# Altium project 平衡车Board_V1.0.PrjPCB
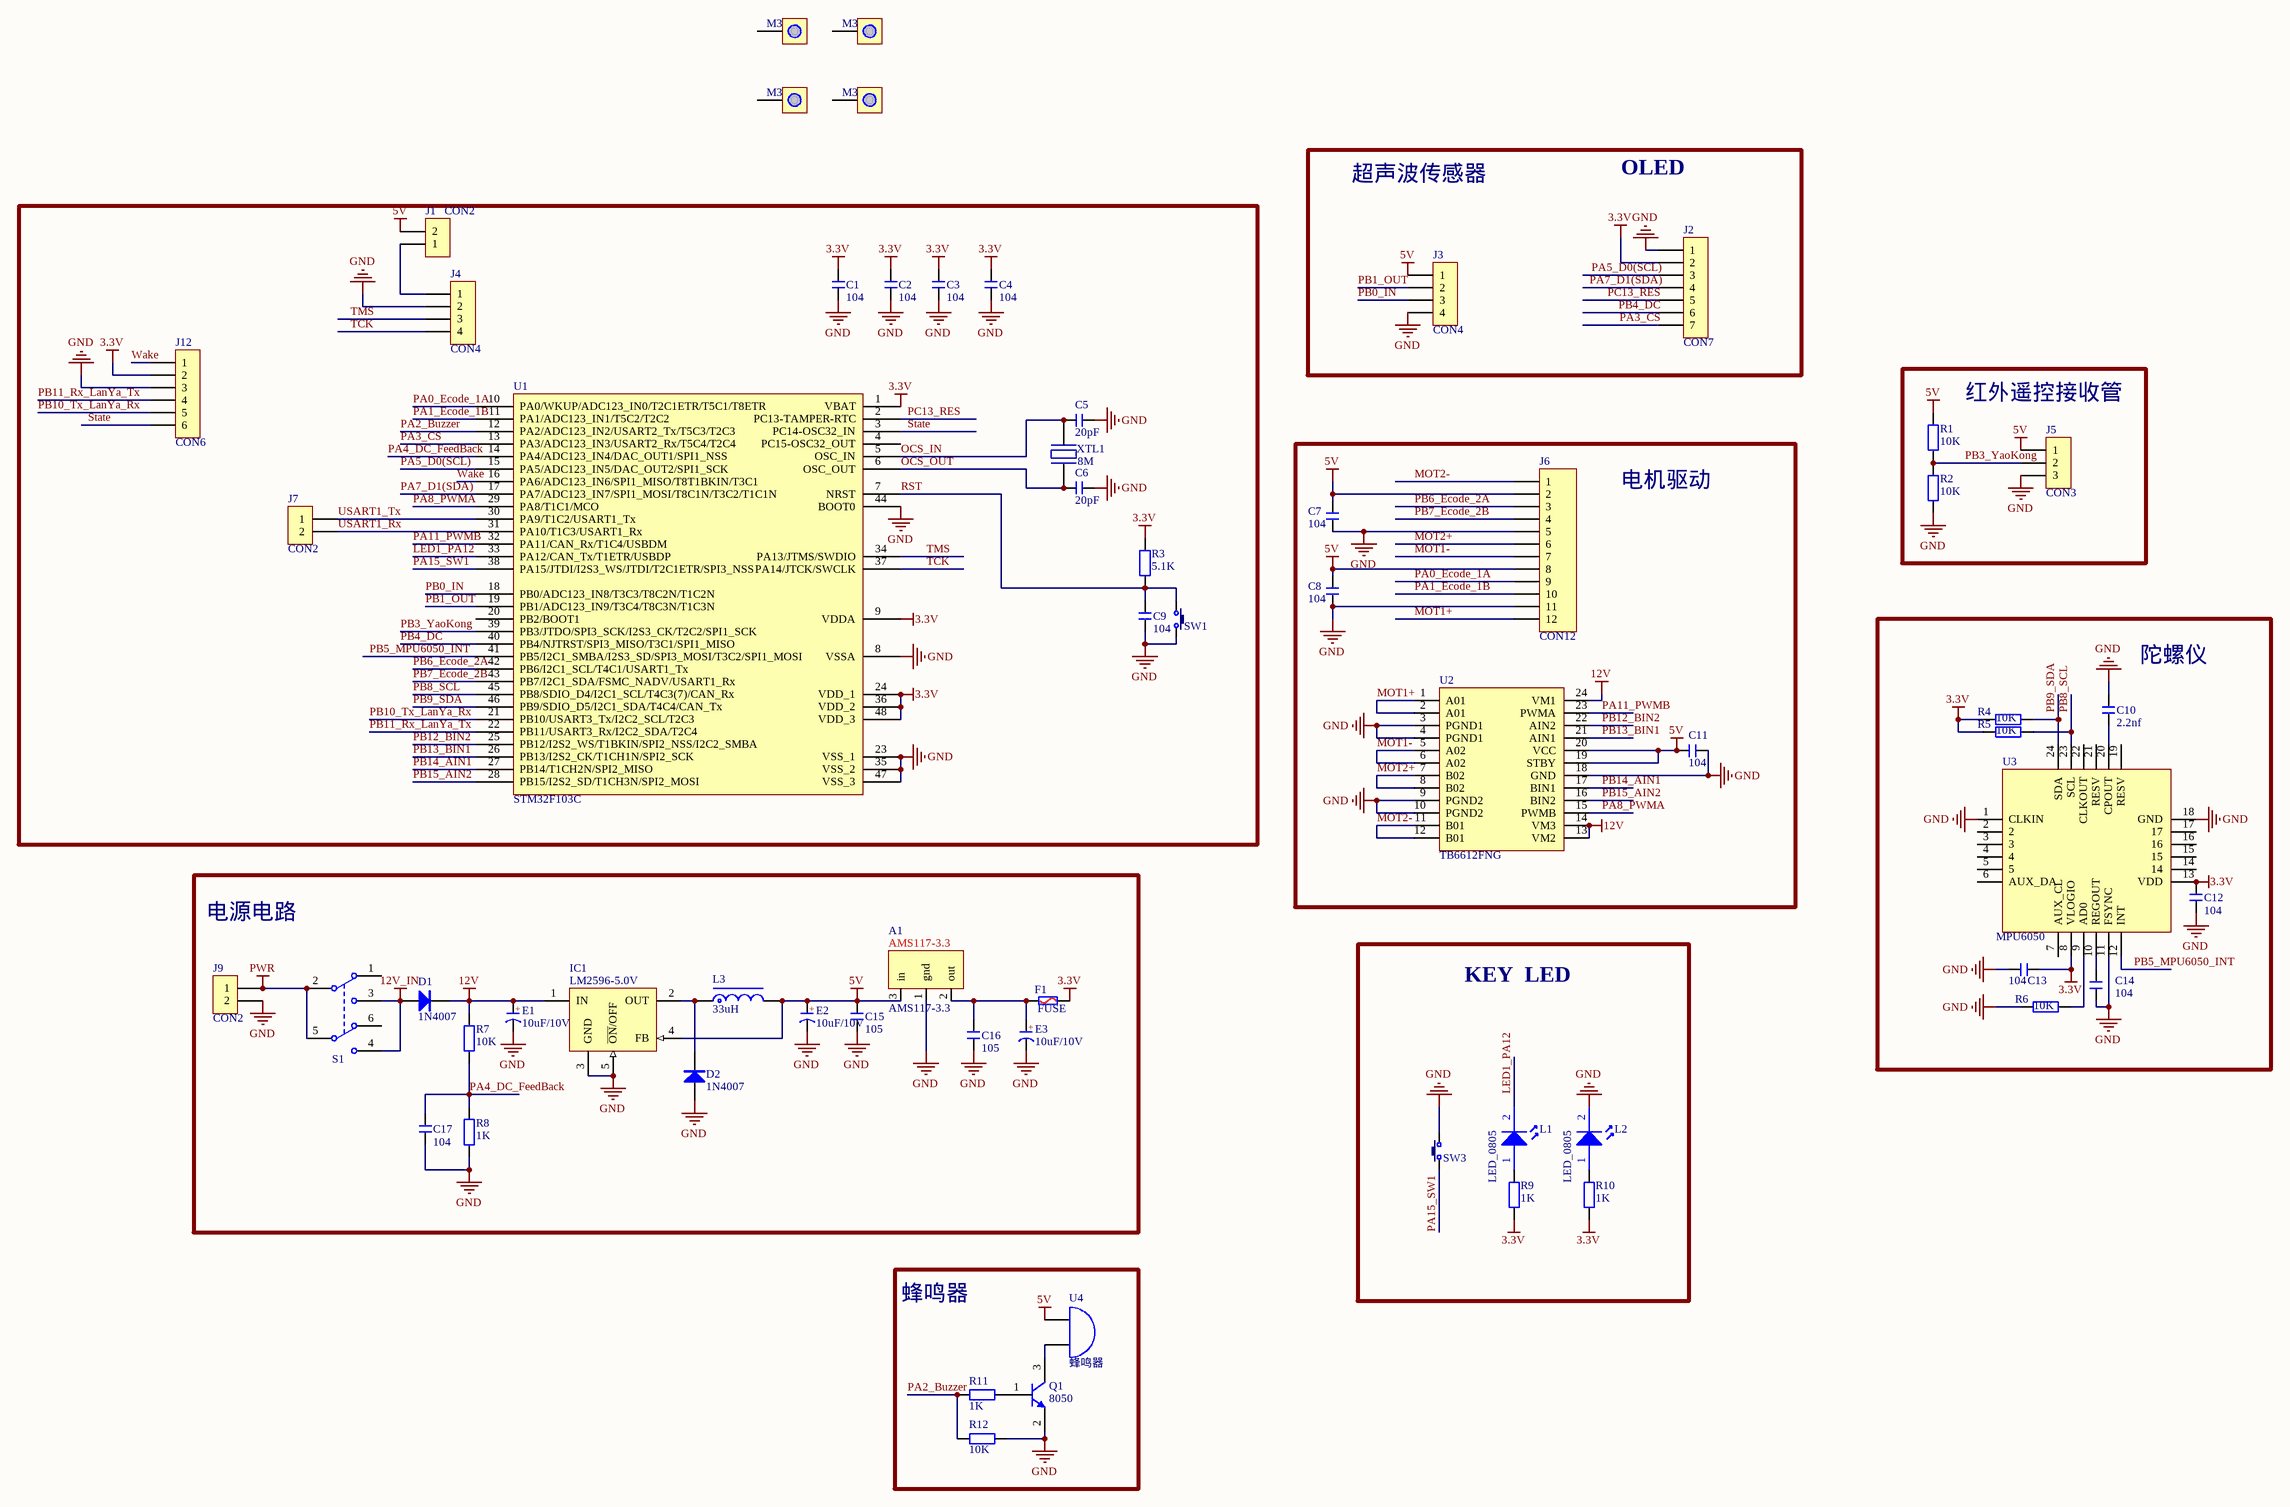
[diagram p0: 平衡车Board_V1.0.SchDoc]
1 sheet, 62 parts. Net scope: global (net labels, ports and power ports of the same name join across sheets).
Board file: 平衡车Board_V1.0.PcbDoc

## Sheet 平衡车Board_V1.0.SchDoc
size A2; PageSetup: Record=PageOptions|CenterHorizontal=True|CenterVertical=True|PrintScale=0.70|XCorrection=1.00|YCorrection=1.00|PrintKind=1|BorderSize=5000000|LeftOffset=0|BottomOffset=0|Orientation=2|PaperLength=1000|PaperWidth=1000|Scale=100|PaperSource=15|PrintQuality=600|MediaType=1|DitherType=10|PaperKind=A3|PrintScaleMode=1

### Parts
A1  AMS117-3.3  [SOT223_N]
C1  104  [C 0603_M]
C2  104  [C 0603_M]
C3  104  [C 0603_M]
C4  104  [C 0603_M]
C5  20pF  [C 0603_M]
C6  20pF  [C 0603_M]
C7  104  [C 0603_M]
C8  104  [C 0603_M]
C9  104  [C 0603_M]
C10  2.2nf  [C 0603_M]
C11  104  [C 0603_M]
C12  104  [C 0603_M]
C13  104  [C 0603_M]
C14  104  [C 0603_M]
C15  105  [C 0805_M]
C16  105  [C 0805_M]
C17  104  [C 0603_M]
D1  1N4007  [DO-41]
D2  1N4007  [DO-41]
E1  10uF/10V  [CM D(6.3*7.7)]
E2  10uF/10V  [CM D(6.3*7.7)]
E3  10uF/10V  [CM D(6.3*7.7)]
F1  FUSE  [FU 1206]
IC1  LM2596-5.0V  [TO263-5A]
J1  CON2  [HDR2.54-LI-2P]
J2  CON7  [HDR2.54-M-LI-7P - for-Oled]
J3  CON4  [HDR2.54-M-LI-4P]
J4  CON4  [HDR2.54-WI-4P]
J5  CON3  [TO92A - duplicate]
J6  CON12  [XH2.54-LI-12P]
J7  CON2  [HDR2.54-LI-2P]
J9  CON2  [CZ-5.08-L-Z-2P]
J12  CON6  [HDR2.54-M-LI-6P - for-wifi]
L1  LED_0805  [LED 0805G]
L2  LED_0805  [LED 0805G]
L3  33uH  [NR3012]
M3  M3  [M3x20_L]  (value not drawn)
M4  M3  [M3x20_L]  (value not drawn)
M5  M3  [M3x20_L]  (value not drawn)
M6  M3  [M3x20_L]  (value not drawn)
Q1  8050  [SOT23-3M]
R1  10K  [R 0603_M]
R2  10K  [R 0603_M]
R3  5.1K  [R 0603_M]
R4  10K  [R 0603_M]
R5  10K  [R 0603_M]
R6  10K  [R 0603_M]
R7  10K  [R 0603_M]
R8  1K  [R 0603_M]
R9  1K  [R 0603_M]
R10  1K  [R 0603_M]
R11  1K  [R 0603_M]
R12  10K  [R 0603_M]
S1  SK-22D02  [SK-22D02]  (value not drawn)
SW1  3x6x5  [TSW DIP-6*6*5]  (value not drawn)
SW3  3x6x5  [TSW DIP-6*6*5]  (value not drawn)
U1  STM32F103C  [LQFP48 7X7_M]
U2  TB6612FNG  [SSOP24_M]
U3  MPU6050  [QFN24 4x4_M]
U4  蜂鸣器  [BEEP 5x9x5.5]
XTL1  8M  [OSC HC-49S]

### Blocks framed on the sheet
红外遥控接收管: J5 R1 R2
电机驱动: C7 C8 C11 J6 U2
陀螺仪: C10 C12-C14 R4-R6 U3
电源电路: A1 C15-C17 D1 D2 E1-E3 F1 IC1 J9 L3 R7 R8 S1
KEY  LED: L1 L2 R9 R10 SW3
蜂鸣器: Q1 R11 R12 U4

### Nets
3.3V: C1.2 C2.2 C3.2 C4.2 C12.2 C13.1 F1.1 J2.2 J12.2 R3.2 R4.2 R5.2 R9.1 R10.1 U1.1(VBAT) U1.9(VDDA) U1.24(VDD_1) U1.36(VDD_2) U1.48(VDD_3) U3.8(VLOGIO) U3.13(VDD)
5V: A1.3(in) C7.2 C8.2 C11.2 C15.2 E2.1(A) IC1.4(FB) J1.2 J3.1 J5.1 J6.2 J6.8 L3.2 R1.2 U2.19(STBY) U2.20(VCC) U4.1(A)
12V: D1.2(K) E1.1(A) IC1.1(IN) R7.2 U2.13(VM2) U2.14(VM3) U2.24(VM1)
12V_IN: D1.1(A) S1.3 S1.4
GND: A1.1(gnd) C1.1 C2.1 C3.1 C4.1 C5.1 C6.1 C7.1 C8.1 C9.1 C10.2 C11.1 C12.1 C13.2 C14.1 C15.1 C16.1 C17.1 D2.1(A) E1.2(K) E2.2(K) E3.2(K) IC1.3(GND) IC1.5(~{ON}/OFF) J2.1 J3.4 J4.2 J5.3 J6.5 J6.11 J9.2 J12.3 L2.2 Q1.2(E) R2.2 R6.2 R8.1 R12.1 SW1.2 SW3.2 U1.8(VSSA) U1.23(VSS_1) U1.35(VSS_2) U1.44(BOOT0) U1.47(VSS_3) U2.3(PGND1) U2.4(PGND1) U2.9(PGND2) U2.10(PGND2) U2.18(GND) U3.1(CLKIN) U3.11(FSYNC) U3.18(GND)
PWR: J9.1 S1.2 S1.5
LED1_PA12: L1.2 U1.33(PA12/CAN_Tx/T1ETR/USBDP)
MOT1+: J6.12 U2.1(A01) U2.2(A01)
MOT1-: J6.7 U2.5(A02) U2.6(A02)
MOT2+: J6.6 U2.7(B02) U2.8(B02)
MOT2-: J6.1 U2.11(B01) U2.12(B01)
OCS_IN: C5.2 U1.5(OSC_IN) XTL1.2
OCS_OUT: C6.2 U1.6(OSC_OUT) XTL1.1
PA0_Ecode_1A: J6.9 U1.10(PA0/WKUP/ADC123_IN0/T2C1ETR/T5C1/T8ETR)
PA1_Ecode_1B: J6.10 U1.11(PA1/ADC123_IN1/T5C2/T2C2)
PA2_Buzzer: R11.2 R12.2 U1.12(PA2/ADC123_IN2/USART2_Tx/T5C3/T2C3)
PA3_CS: J2.7 U1.13(PA3/ADC123_IN3/USART2_Rx/T5C4/T2C4)
PA4_DC_FeedBack: C17.2 R7.1 R8.2 U1.14(PA4/ADC123_IN4/DAC_OUT1/SPI1_NSS)
PA5_D0(SCL): J2.3 U1.15(PA5/ADC123_IN5/DAC_OUT2/SPI1_SCK)
PA7_D1(SDA): J2.4 U1.17(PA7/ADC123_IN7/SPI1_MOSI/T8C1N/T3C2/T1C1N)
PA8_PWMA: U1.29(PA8/T1C1/MCO) U2.15(PWMB)
PA11_PWMB: U1.32(PA11/CAN_Rx/T1C4/USBDM) U2.23(PWMA)
PA15_SW1: SW3.1 U1.38(PA15/JTDI/I2S3_WS/JTDI/T2C1ETR/SPI3_NSS)
PB0_IN: J3.3 U1.18(PB0/ADC123_IN8/T3C3/T8C2N/T1C2N)
PB1_OUT: J3.2 U1.19(PB1/ADC123_IN9/T3C4/T8C3N/T1C3N)
PB3_YaoKong: J5.2 R1.1 R2.1 U1.39(PB3/JTDO/SPI3_SCK/I2S3_CK/T2C2/SPI1_SCK)
PB4_DC: J2.6 U1.40(PB4/NJTRST/SPI3_MISO/T3C1/SPI1_MISO)
PB5_MPU6050_INT: U1.41(PB5/I2C1_SMBA/I2S3_SD/SPI3_MOSI/T3C2/SPI1_MOSI) U3.12(INT)
PB6_Ecode_2A: J6.3 U1.42(PB6/I2C1_SCL/T4C1/USART1_Tx)
PB7_Ecode_2B: J6.4 U1.43(PB7/I2C1_SDA/FSMC_NADV/USART1_Rx)
PB8_SCL: R5.1 U1.45(PB8/SDIO_D4/I2C1_SCL/T4C3(7)/CAN_Rx) U3.23(SCL)
PB9_SDA: R4.1 U1.46(PB9/SDIO_D5/I2C1_SDA/T4C4/CAN_Tx) U3.24(SDA)
PB10_Tx_LanYa_Rx: J12.5 U1.21(PB10/USART3_Tx/I2C2_SCL/T2C3)
PB11_Rx_LanYa_Tx: J12.4 U1.22(PB11/USART3_Rx/I2C2_SDA/T2C4)
PB12_BIN2: U1.25(PB12/I2S2_WS/T1BKIN/SPI2_NSS/I2C2_SMBA) U2.22(AIN2)
PB13_BIN1: U1.26(PB13/I2S2_CK/T1CH1N/SPI2_SCK) U2.21(AIN1)
PB14_AIN1: U1.27(PB14/T1CH2N/SPI2_MISO) U2.17(BIN1)
PB15_AIN2: U1.28(PB15/I2S2_SD/T1CH3N/SPI2_MOSI) U2.16(BIN2)
PC13_RES: J2.5 U1.2(PC13-TAMPER-RTC)
RST: C9.2 R3.1 SW1.1 U1.7(NRST)
State: J12.6 U1.3(PC14-OSC32_IN)
TCK: J4.4 U1.37(PA14/JTCK/SWCLK)
TMS: J4.3 U1.34(PA13/JTMS/SWDIO)
USART1_Rx: J7.2 U1.31(PA10/T1C3/USART1_Rx)
USART1_Tx: J7.1 U1.30(PA9/T1C2/USART1_Tx)
Wake: J12.1 U1.16(PA6/ADC123_IN6/SPI1_MISO/T8T1BKIN/T3C1)
NetA1_2: A1.2(out) C16.2 E3.1(A) F1.2
NetC10_1: C10.1 U3.20(CPOUT)
NetC14_2: C14.2 U3.10(REGOUT)
NetD2_2: D2.2(K) IC1.2(OUT) L3.1
NetJ1_1: J1.1 J4.1
NetL1_1: L1.1 R9.2
NetL2_1: L2.1 R10.2
NetQ1_1: Q1.1(B) R11.1
NetQ1_3: Q1.3(C) U4.2(B)
NetR6_1: R6.1 U3.9(AD0)

Not connected (* = marked no-connect by the designer): M3 1(A); M4 1(A); M5 1(A); M6 1(A); S1 1 6; U1 4(PC15-OSC32_OUT) 20(PB2/BOOT1); U3 2 3 4 5 6(AUX_DA) 7(AUX_CL) 14 15 16 17 19(RESV) 21(RESV) 22(CLKOUT)

### Notes on the sheet
- 超声波传感器
- OLED
- (in symbol C-CM) +

### Library data of the parts
C1-C17 = C: 无极性贴片电容; 版权归属: 源创客; BOM名称: 无极性贴片电容; 学习资源: www.ooocke.com
D1 D2 = 1N4007: 整流二极管; 版权归属: 源创客; BOM名称: 整流二极管; 学习资源: www.ooocke.com
E1-E3 = C-CM: 贴片电解电容; 版权归属: 源创客; BOM名称: 贴片电解电容; 学习资源: www.ooocke.com
IC1 = LM2596-5.0: DC降压芯片; BOM名称: DC稳压芯片; 版权归属: 源创客; 学习资源: www.ooocke.com
J1 J7 J9 = CON2: Connector
J2 = CON7: Connector
J3 J4 = CON4: Connector
J5 = CON3: Connector
J6 = CON12: Connector
J12 = CON6: Connector
L3 = L-NR: NR磁胶电感; 版权归属: 源创客; BOM名称: NR磁胶电感; 学习资源: www.ooocke.com
Q1 = NPN
R1-R12 = R: 贴片电阻; 版权归属: 源创客; BOM名称: 贴片电阻; 学习资源: www.ooocke.com
S1 = SSW-2P: 2路波动开关; BOM名称: 波动开关; 版权归属: 源创客; 学习资源: www.ooocke.com
SW1 SW3 = TSW 3x6: 3x6轻触开关; 版权归属: 源创客; BOM名称: 3x6轻触开关; 学习资源: www.ooocke.com
U1 = STM32F103C: STM32单片机48引脚
U2 = TB6612FNG: 直流电机驱动芯片
U3 = MPU6050: 陀螺仪
U4 = 蜂鸣器: Bell
XTL1 = XTL